# EAGLE design interface_dac_sma_feedback_2PS_ADC_detector_ACDC (EAGLE 7.2.0)
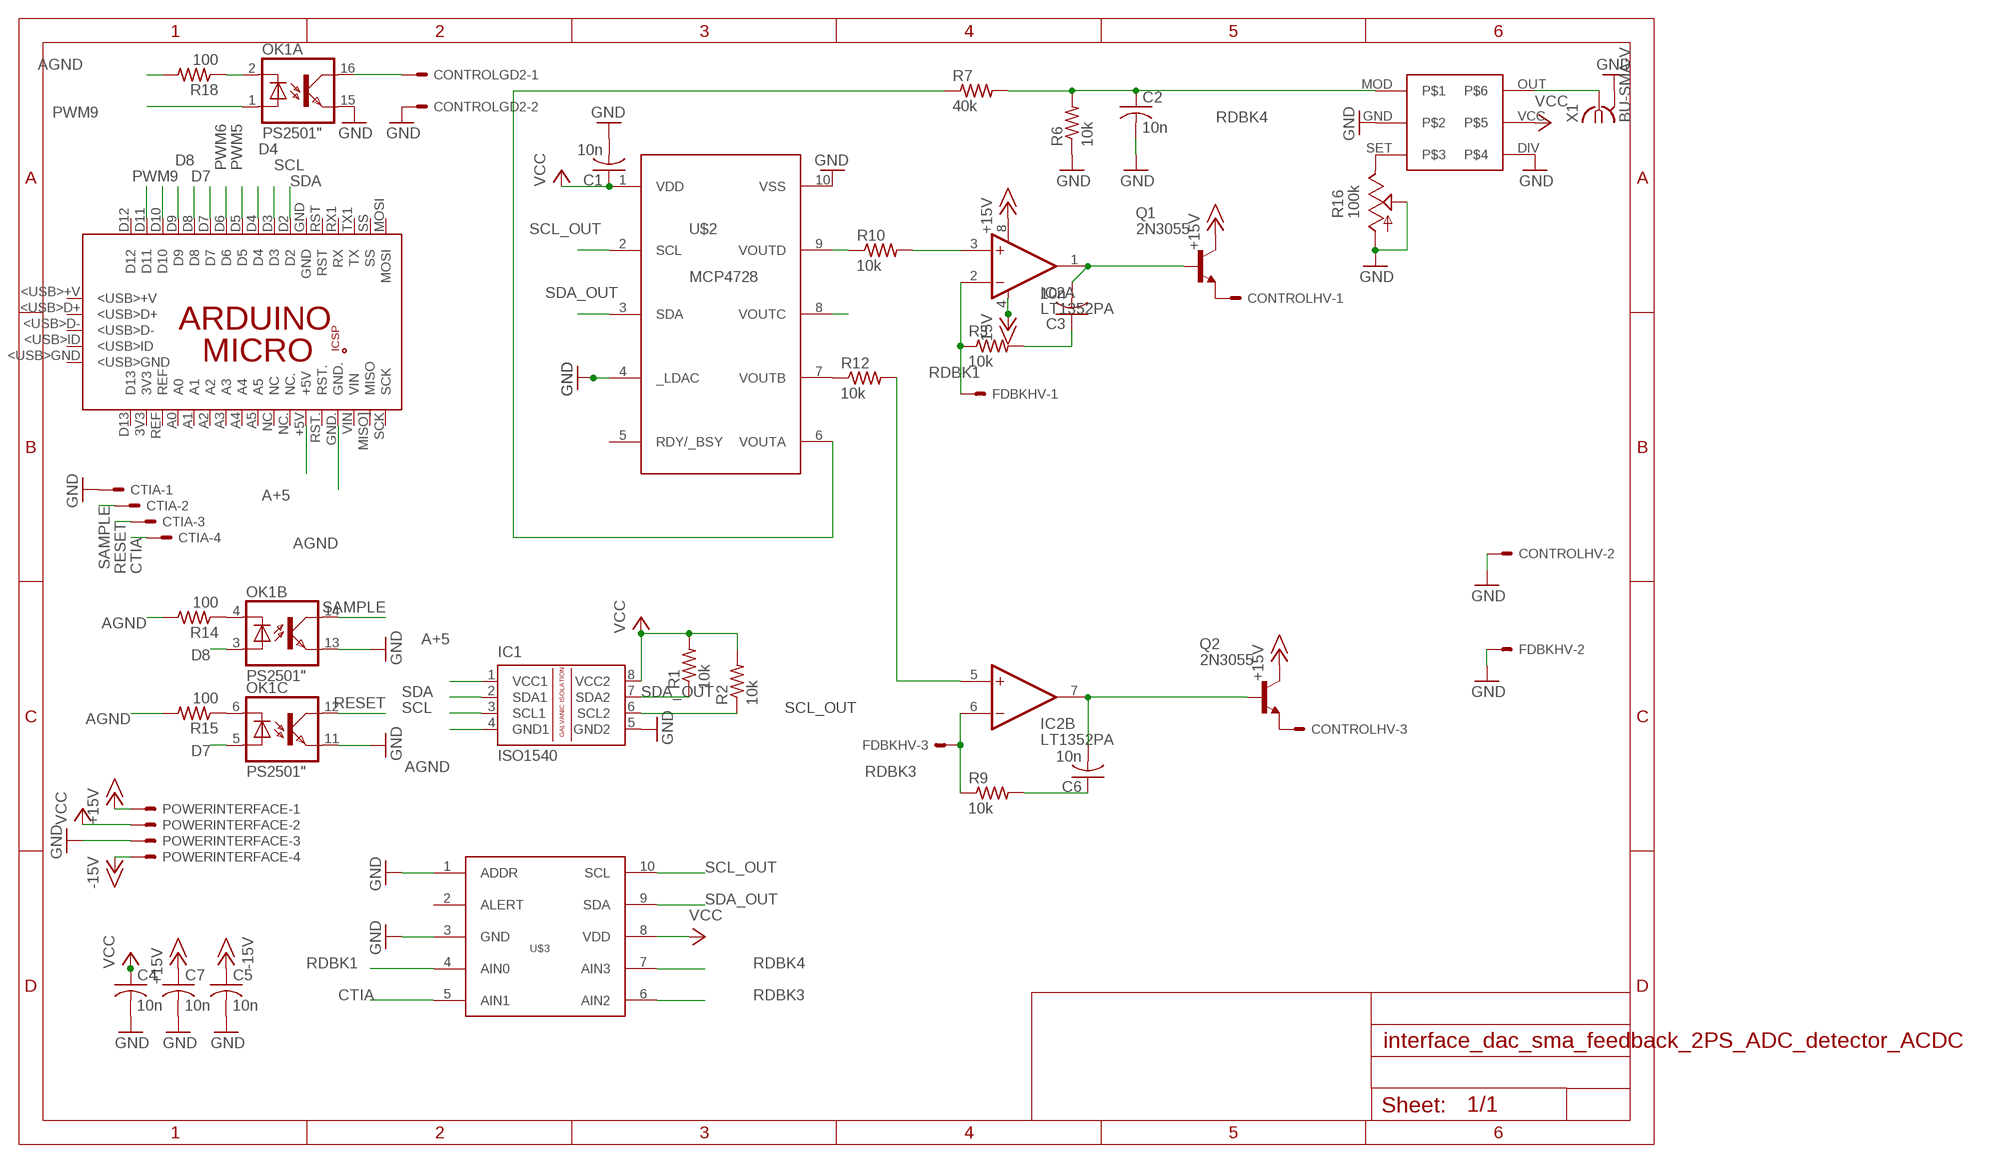
[diagram p0: schematic, sheet 1]

## Parts
C1  10n  C-US050-024X044  [C050-024X044]
C2  10n  C-US050-024X044  [C050-024X044]
C3  10n  C-US050-024X044  [C050-024X044]
C4  10n  C-US050-024X044  [C050-024X044]
C5  10n  C-US050-024X044  [C050-024X044]
C6  10n  C-US050-024X044  [C050-024X044]
C7  10n  C-US050-024X044  [C050-024X044]
CONTROLGD2  KK-156-2  [KK-156-2]
CONTROLHV  KK-156-3  [KK-156-3]
CTIA  KK-156-4  [KK-156-4]
FDBKHV  KK-156-3  [KK-156-3]
IC1  ISO1540  [DIL08]
IC2  LT1352PA  [DIL08]
OK1  PS2501"  [DIL16]
PCB1  ARDUINO_MICRO  [ARDUINO_MICRO]
POWERINTERFACE  KK-156-4  [KK-156-4]
Q1  2N3055  [TO3]
Q2  2N3055  [TO3]
R1  10k  R-US_0207/12  [0207/12]
R2  10k  R-US_0207/10  [0207/10]
R3  10k  R-US_0207/10  [0207/10]
R6  10k  R-US_0207/10  [0207/10]
R7  40k  R-US_0207/10  [0207/10]
R9  10k  R-US_0207/10  [0207/10]
R10  10k  R-US_0207/10  [0207/10]
R12  10k  R-US_0207/10  [0207/10]
R14  100  R-US_0207/10  [0207/10]
R15  100  R-US_0207/10  [0207/10]
R16  100k  TRIM_US-B90P  [SP19L]
R18  100  R-US_0207/10  [0207/10]
U$1  LTC6992  [DIL06]
U$2  MCP4728DIL  [DIL10]
U$3  ADS1015DIL  [DIL10]
X1  BU-SMA-V  [BU-SMA-V]

## Nets
+15V: C7.1 IC2.8(A:V+) POWERINTERFACE.1 Q1.C Q1.C/(C) Q2.C Q2.C/(C)
-15V: C5.1 IC2.4(A:V-) POWERINTERFACE.4
A+5: IC1.1(VCC1) PCB1.+5V
AGND: IC1.4(GND1) PCB1.GND. R14.2 R15.2 R18.2
CTIA: CTIA.4 U$3.5(AIN1)
D4: PCB1.D4
D7: OK1.5(C:A) PCB1.D7
D8: OK1.3(B:A) PCB1.D8
D10: PCB1.D10
D11: PCB1.D11
ENSW2: CONTROLGD2.1 OK1.16(A:COL)
GND: C1.2 C2.2 C4.2 C5.2 C7.2 CONTROLGD2.2 CONTROLHV.2 CTIA.1 FDBKHV.2 IC1.5(GND2) OK1.11(C:EMI) OK1.13(B:EMI) OK1.15(A:EMI) POWERINTERFACE.3 R6.1 R16.A R16.S U$1.DIV U$1.GND U$2.4(_LDAC) U$2.10(VSS) U$3.1(ADDR) U$3.3(GND) X1.2 X1.3 X1.4 X1.5
N$1: R7.1 U$2.6(VOUTA)
N$2: OK1.4(B:C) R14.1
N$3: C3.1 R3.2
N$4: CONTROLHV.1 Q1.E
N$5: CONTROLHV.3 Q2.E
N$6: OK1.6(C:C) R15.1
N$7: OK1.2(A:C) R18.1
N$12: R16.E U$1.SET
N$13: U$1.OUT X1.1
N$16: IC2.3(A:+IN) R10.2
N$18: IC2.5(B:+IN) R12.2
N$19: C3.2 IC2.1(A:OUT) Q1.B
N$20: C6.1 R9.2
N$21: C6.2 IC2.7(B:OUT) Q2.B
N$24: R10.1 U$2.9(VOUTD)
N$25: R12.1 U$2.7(VOUTB)
N$26: U$2.8(VOUTC)
PWM5: PCB1.D5
PWM6: PCB1.D6
PWM9: OK1.1(A:A) PCB1.D9
RDBK1: FDBKHV.1 IC2.2(A:-IN) R3.1 U$3.4(AIN0)
RDBK3: FDBKHV.3 IC2.6(B:-IN) R9.1 U$3.6(AIN2)
RDBK4: C2.1 R6.2 R7.2 U$1.MOD U$3.7(AIN3)
RESET: CTIA.3 OK1.12(C:COL)
SAMPLE: CTIA.2 OK1.14(B:COL)
SCL: IC1.3(SCL1) PCB1.D3
SCL_OUT: IC1.6(SCL2) R2.1 U$2.2(SCL) U$3.10(SCL)
SDA: IC1.2(SDA1) PCB1.D2
SDA_OUT: IC1.7(SDA2) R1.1 U$2.3(SDA) U$3.9(SDA)
VCC: C1.1 C4.1 IC1.8(VCC2) POWERINTERFACE.2 R1.2 R2.2 U$1.VCC U$2.1(VDD) U$3.8(VDD)
Unconnected: OK1.7(D:A) OK1.8(D:C) OK1.9(D:EMI) OK1.10(D:COL) PCB1.3V3 PCB1.5V PCB1.<USB>+V PCB1.<USB>D+ PCB1.<USB>D- PCB1.<USB>GND PCB1.<USB>ID PCB1.A0 PCB1.A1 PCB1.A2 PCB1.A3 PCB1.A4 PCB1.A5 PCB1.D12 PCB1.D13 PCB1.GND PCB1.GND_ PCB1.MISO. PCB1.MISO](MISO) PCB1.MOSI PCB1.MOSI. PCB1.NC PCB1.NC. PCB1.REF PCB1.RESET.. PCB1.RST PCB1.RST. PCB1.RX1(RX) PCB1.SCK PCB1.SCK. PCB1.SS PCB1.TX1(TX) PCB1.VIN U$2.5(RDY/_BSY) U$3.2(ALERT)

## Library data of the parts
C1 = rcl:C-US: CAPACITOR, American symbol
C2-C7 = resistor:C-US: CAPACITOR, American symbol
CONTROLGD2 = con-molex:KK-156-2: KK 156 HEADER Source: http://www.molex.com/pdm_docs/sd/026604100_sd.pdf; OC_FARNELL: unknown; OC_NEWARK: unknown
CONTROLHV FDBKHV = con-molex:KK-156-3: KK 156 HEADER Source: http://www.molex.com/pdm_docs/sd/026604100_sd.pdf; OC_FARNELL: unknown; OC_NEWARK: unknown
CTIA POWERINTERFACE = con-molex:KK-156-4: KK 156 HEADER Source: http://www.molex.com/pdm_docs/sd/026604100_sd.pdf; OC_FARNELL: unknown; OC_NEWARK: unknown
IC1 = texas:ISO1540: ISOLATED CAN TRANSCEIVER Source: http://focus.ti.com/lit/ds/symlink/iso1050.pdf
IC2 = linear-technology:LT1352: Dual Operational Amplifiers Source: http://datasheets.maxim-ic.com/en/ds/ICL7612-ICL764X.pdf; OC_FARNELL: unknown; OC_NEWARK: unknown
OK1 = optocoupler:PS2501: SHARP OPTO COUPLER
PCB1 = E14_Arduino_published:ARDUINO_MICRO: Device for representing an Arduino Micro board with a footprint in an EAGLE design. Created by Dave Young for Element14. More EAGLE documentation at: http://www.element14.com/community/community/knode/cadsoft_eagle
Q1 Q2 = transistor-npn:2N3055: NPN Transistor
R1-R3 R6 R7 R9 R10 R12 = resistor:R-US_: RESISTOR, American symbol
R14 R15 R18 = rcl:R-US_: RESISTOR, American symbol
R16 = pot:TRIM_US-: POTENTIOMETER
U$1 = linear-technology:LTC6992
U$2 = microchip:MCP4728
U$3 = texas:ADS1015
X1 = con-coax:BU-SMA-V: FEMALE SMA CONNECTOR Radiall distributor RS 112-3794; OC_FARNELL: unknown; OC_NEWARK: unknown

## Board
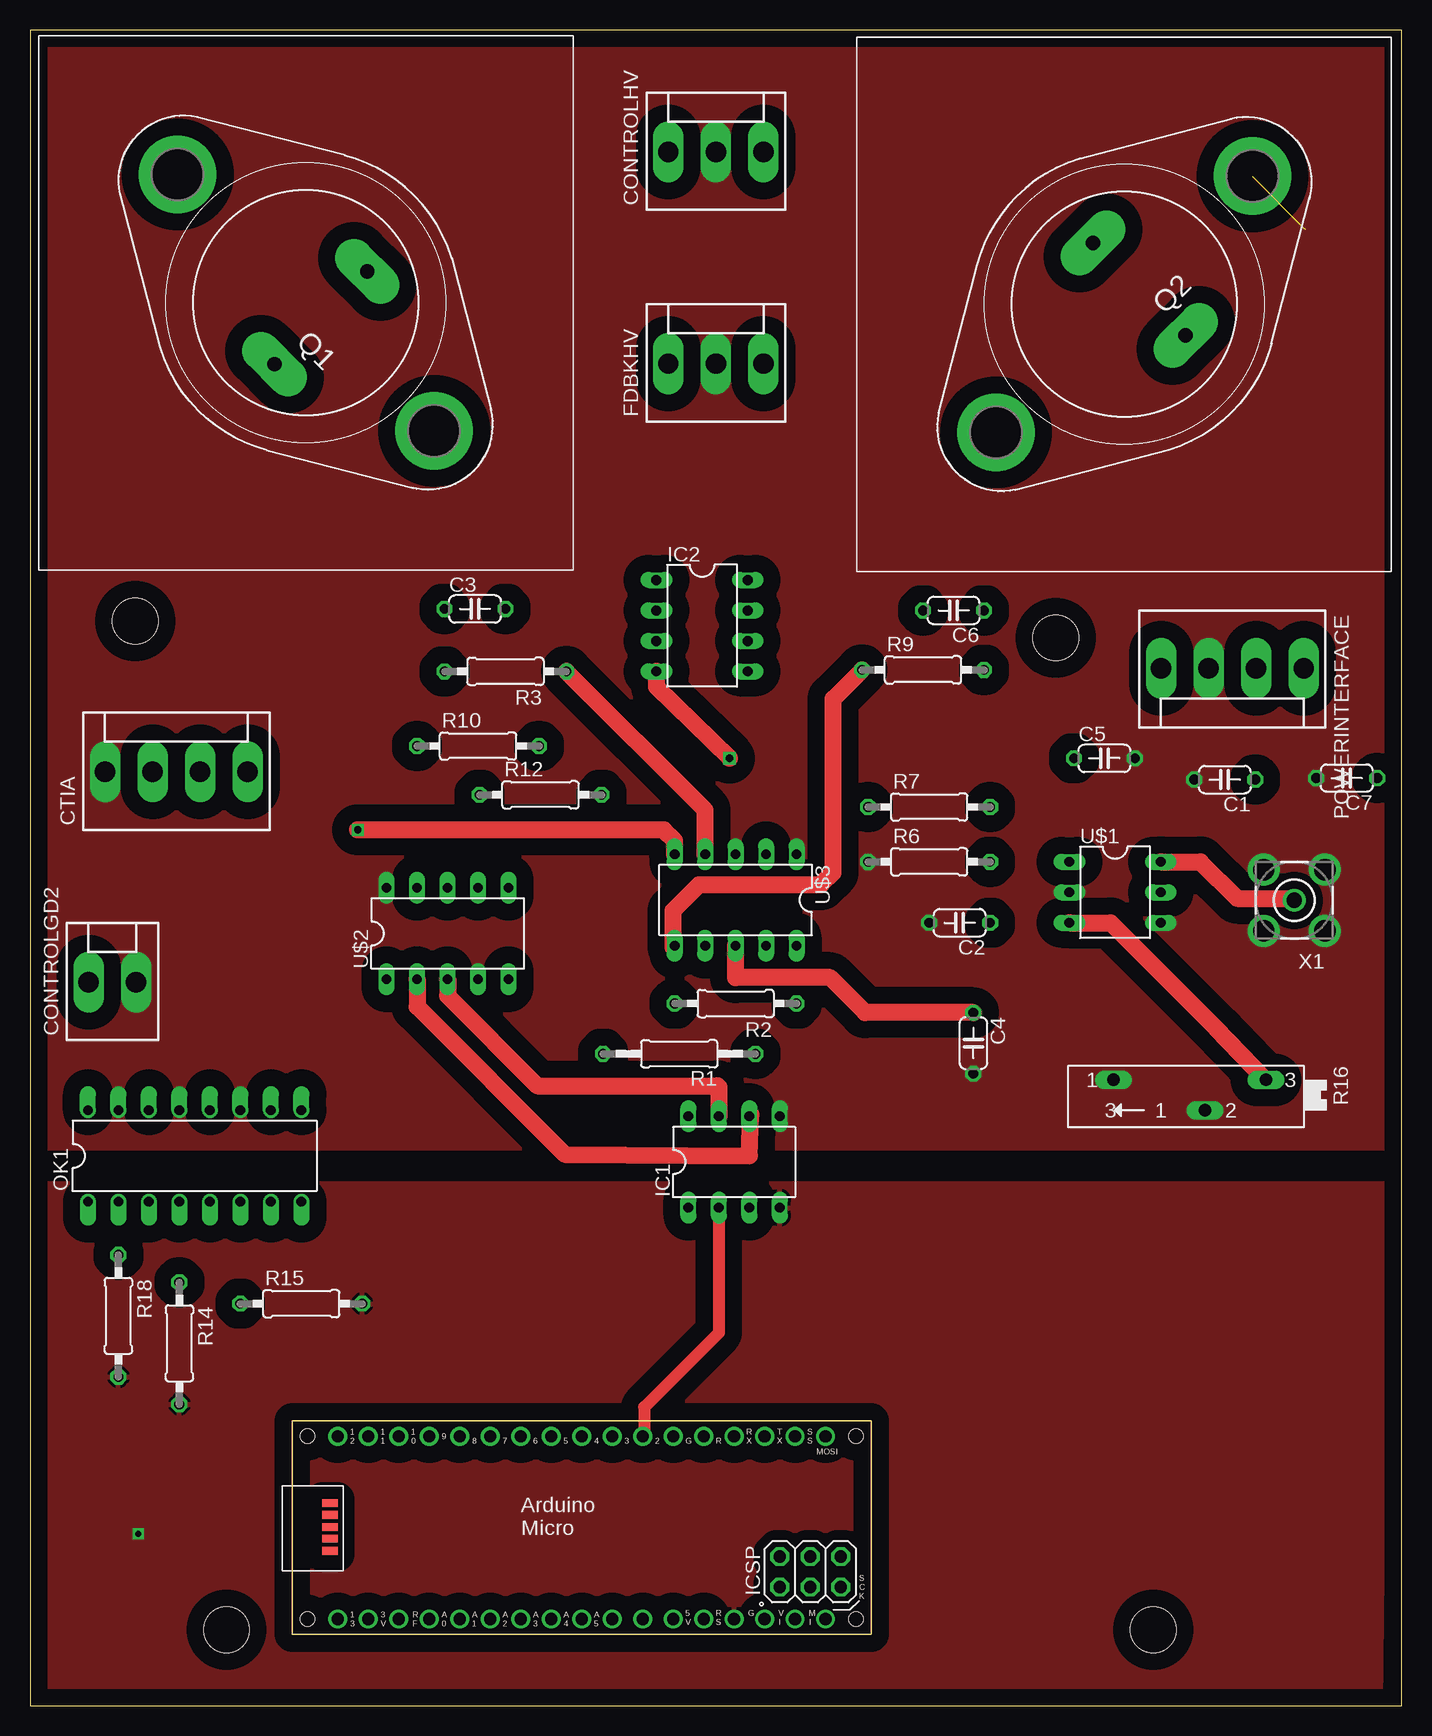
[diagram p1: board, top side]
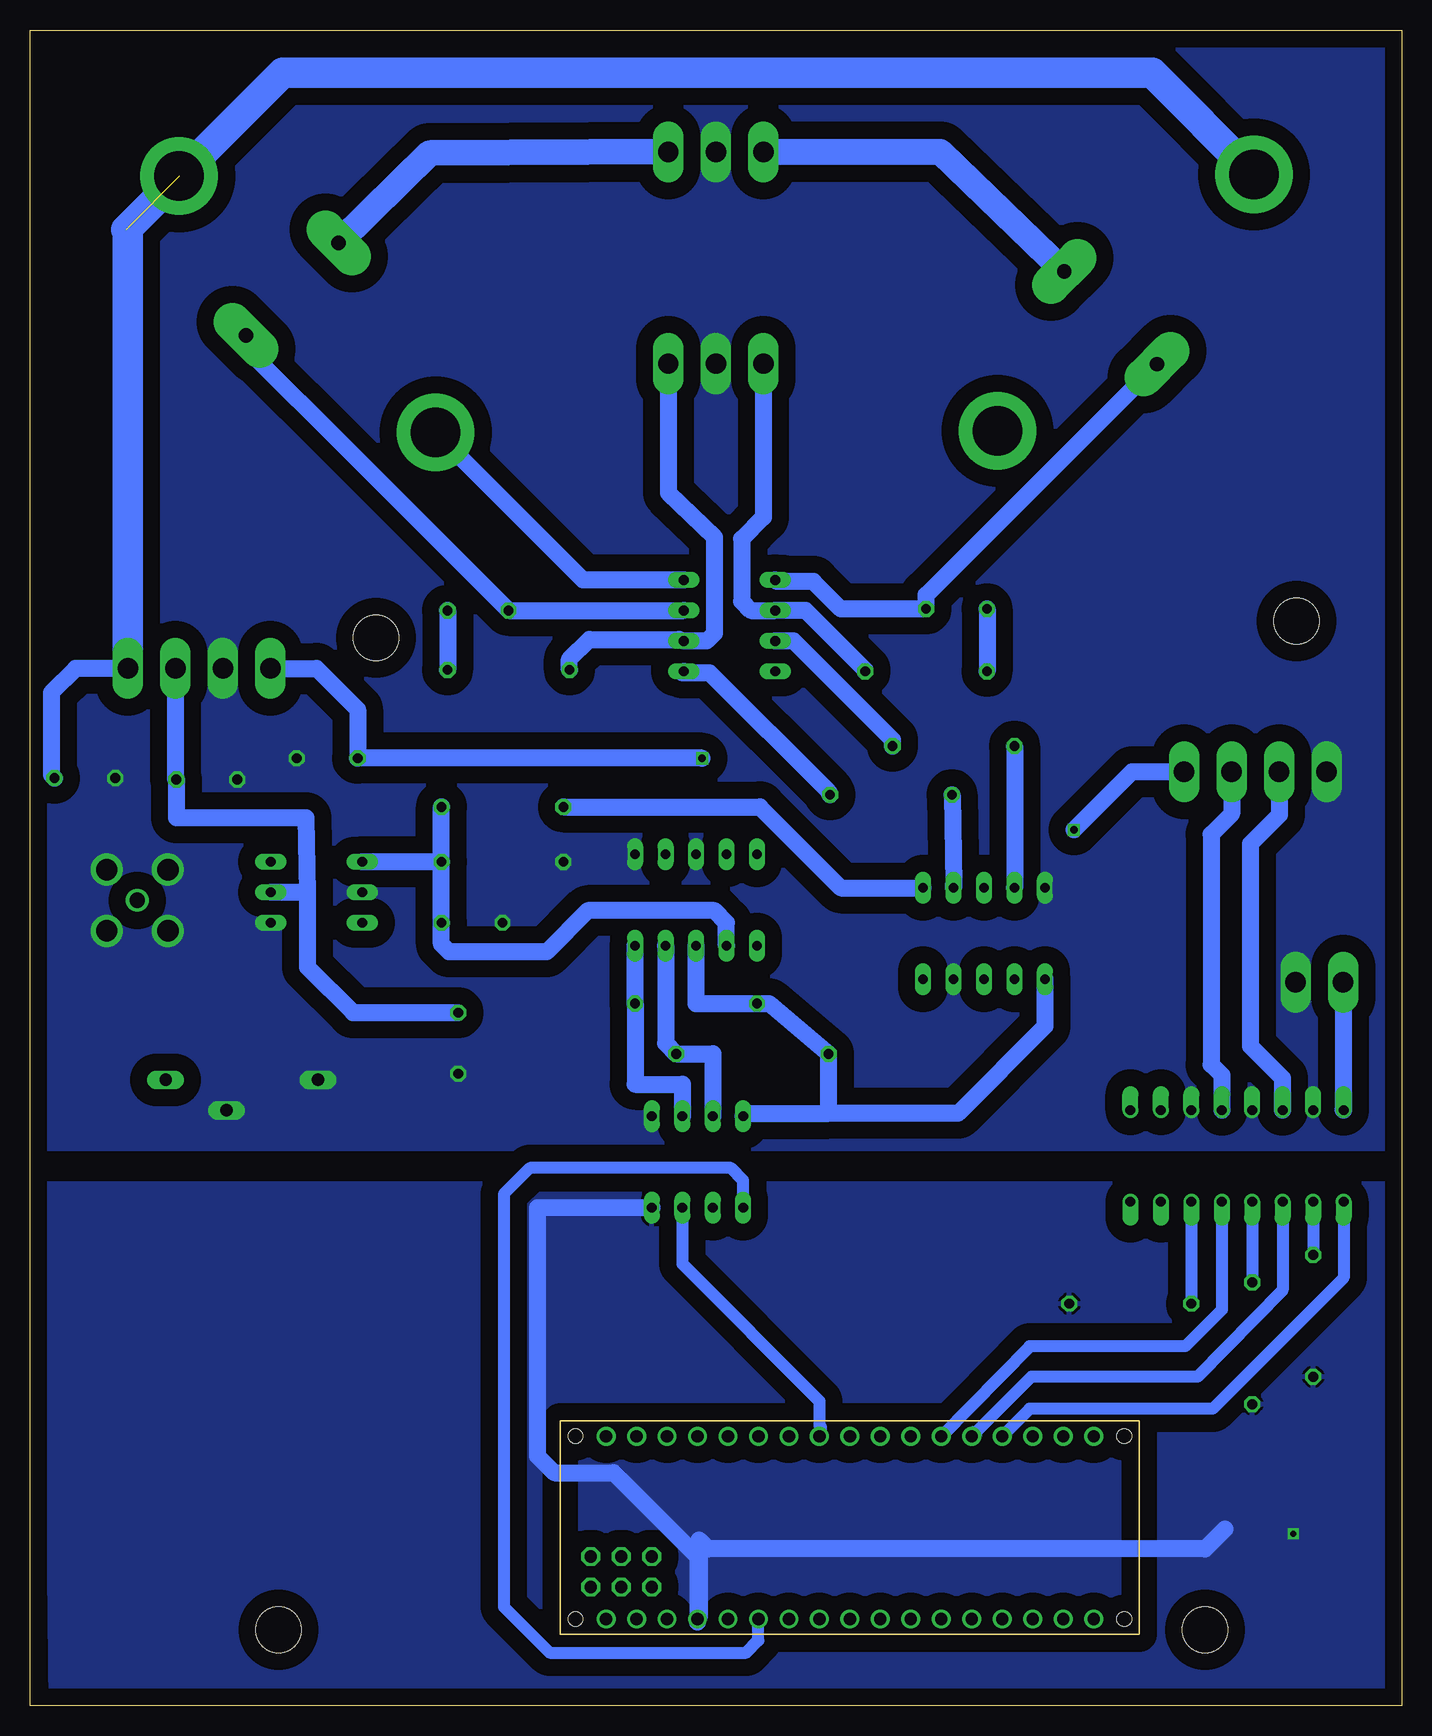
[diagram p2: board, bottom side, seen from below]

Size 114.3 x 139.7 mm. Coordinates in mm from the lower left corner, seen from the top.
Outline: 0,0 114.3,0 114.3,139.7 0,139.7 0,0
Copper layers (1*16): Top 0.035mm / dielectric 1.5mm / Bottom 0.035mm
Design rules "default *": minimum track width 6mil, minimum drill 15mil, track to track 6mil, track to pad 6mil, pad to pad 6mil, via to via 6mil, smd to smd 6mil, copper to edge 40mil, drill to drill 8mil, minimum pad ring 10mil, minimum via ring 8mil, stop-mask expansion 4mil, vias tented up to drill 0mil, thermal gap 10mil
Holes 3.8 mm at 93.6,6.35 16.38,6.35 8.76,90.42 85.47,89.03

### Footprints (pad centres in the part's own frame; a part is rotated, then mirrored left to right if it is on the bottom)
C050-024X044 = drill 0.813 octagon: 1 -2.54,0; 2 2.54,0
KK-156-2 = drill 1.7 pad 2.184 long: 1 -1.98,0; 2 1.98,0
KK-156-3 = drill 1.7 pad 2.184 long: 1 -3.96,0; 2 0,0; 3 3.96,0
KK-156-4 = drill 1.7 pad 2.184 long: 1 -5.94,0; 2 -1.98,0; 3 1.98,0; 4 5.94,0
DIL08 = drill 0.813 long: 1 -3.81,-3.81; 2 -1.27,-3.81; 3 1.27,-3.81; 4 3.81,-3.81; 5 3.81,3.81; 6 1.27,3.81; 7 -1.27,3.81; 8 -3.81,3.81
DIL16 = drill 0.813 offset: 1 -8.89,-3.81; 2 -6.35,-3.81; 3 -3.81,-3.81; 4 -1.27,-3.81; 5 1.27,-3.81; 6 3.81,-3.81; 7 6.35,-3.81; 8 8.89,-3.81; 9 8.89,3.81; 10 6.35,3.81; 11 3.81,3.81; 12 1.27,3.81; 13 -1.27,3.81; 14 -3.81,3.81; 15 -6.35,3.81; 16 -8.89,3.81
ARDUINO_MICRO = drill 1.016 pad 1.575: 3V3 6.35,1.27; +5V 31.75,1.27; A0 11.43,1.27; A1 13.97,1.27; A2 16.51,1.27; A3 19.05,1.27; A4 21.59,1.27; A5 24.13,1.27; D2 29.21,16.51; D3 26.67,16.51; D4 24.13,16.51; D5 21.59,16.51; D6 19.05,16.51; D7 16.51,16.51; D8 13.97,16.51; D9 11.43,16.51; D10 8.89,16.51; D11 6.35,16.51; D12 3.81,16.51; D13 3.81,1.27; GND 31.75,16.51; GND. 36.83,1.27; MISO] 41.91,1.27; MOSI 44.45,16.51; NC 26.67,1.27; NC. 29.21,1.27; REF 8.89,1.27; RST 34.29,16.51; RST. 34.29,1.27; RX1 36.83,16.51; SCK 44.45,1.27; SS 41.91,16.51; TX1 39.37,16.51; VIN 39.37,1.27 | drill 1.016 pad 1.575 octagon: 5V 40.64,6.477; GND_ 45.72,6.477; MISO. 40.64,3.937; MOSI. 43.18,6.477; RESET.. 45.72,3.937; SCK. 43.18,3.937 | smd 1.27 x 0.635: <USB>+V 3.15,10.947; <USB>D+ 3.15,9.957; <USB>D- 3.15,8.941; <USB>GND 3.15,6.96; <USB>ID 3.15,7.976 | hole 1.2: 1.27,1.27; 1.27,16.51; 46.99,16.51; 46.99,1.27
TO3 = drill 1.194 pad 3.15 long: B -1.778,5.461; E -1.778,-5.461 | drill 4.115 pad 6.477: C 15.113,0; C/ -15.113,0
0207/12 = drill 0.813 octagon: 1 -6.35,0; 2 6.35,0
0207/10 = drill 0.813 octagon: 1 -5.08,0; 2 5.08,0
SP19L = drill 1.016 long: A 5.715,-1.27; E -6.985,-1.27; S -1.905,1.27
DIL06 = drill 0.813 long: DIV 2.54,3.81; GND 0,-3.81; MOD -2.54,-3.81; OUT -2.54,3.81; SET 2.54,-3.81; VCC 0,3.81
DIL10 = drill 0.813 long: 1 -5.08,-3.81; 2 -2.54,-3.81; 3 0,-3.81; 4 2.54,-3.81; 5 5.08,-3.81; 6 5.08,3.81; 7 2.54,3.81; 8 0,3.81; 9 -2.54,3.81; 10 -5.08,3.81
BU-SMA-V = drill 1.27: 1 0,0 | drill 1.778: 2 -2.55,2.55; 3 2.55,2.55; 4 2.55,-2.55; 5 -2.55,-2.55

### Placement (x,y rotation side)
C1  99.57,77.22 180 top
C2  77.47,65.28 180 top
C3  37.08,91.44 0 top
C4  78.61,55.24 270 top
C5  89.53,78.99 0 top
C6  76.96,91.31 180 top
C7  109.73,77.34 180 top
CONTROLGD2  6.86,60.33 0 top
CONTROLHV  57.15,129.54 0 top
CTIA  12.19,77.85 0 top
FDBKHV  57.15,111.89 0 top
IC1  58.67,45.34 0 top
IC2  56.01,90.04 270 top
OK1  13.72,45.85 0 top
PCB1  21.84,5.97 0 top
POWERINTERFACE  100.2,86.49 180 top
Q1  22.99,116.97 135 top
Q2  91.19,116.84 225 top
R1  54.1,54.36 180 top
R2  58.8,58.55 180 top
R3  39.62,86.23 180 top
R6  74.93,70.36 0 top
R7  74.93,74.93 0 top
R9  74.42,86.36 0 top
R10  37.34,80.01 0 top
R12  42.55,75.95 0 top
R14  12.45,30.23 270 top
R15  22.61,33.53 0 top
R16  96.01,50.93 180 top
R18  7.37,32.51 270 top
U$1  90.42,67.82 270 top
U$2  34.8,64.39 0 top
U$3  58.8,67.18 180 top
X1  105.36,67.16 180 top

### Tracks (layer width: path | path; a pad name or v marks a point on that pad's centre or on a via)
+15V  (2 unrouted)
  Bottom 1.422: POWERINTERFACE.1 110.49,86.49 112.52,84.45 112.52,77.6 C7.1 | IC2.8 68.2,93.85 Q2.C
  Bottom 2.54: 106.3,123.06 93.22,136.14 20.79,136.14 Q1.C | POWERINTERFACE.1 106.14,123.16
-15V  (via drill 0.6)
  Top 1.422: IC2.4 52.2,84.96 v58.29,78.99
  Bottom 1.422: POWERINTERFACE.4 90.42,86.49 87,83.06 C5.1 v58.29,78.99
A+5
  Bottom 1.016: PCB1.+5V 53.59,5.46 54.61,4.45 70.99,4.45 72.39,5.84 74.8,8.26 74.8,42.67 72.64,44.83 55.88,44.83 54.86,43.81 IC1.1
AGND  (via drill 0.5 pad 0.3)
  Bottom 1.422: PCB1.GND. 58.67,12.45 65.66,19.43 70.61,19.43 72.01,20.83 72.01,41.53 IC1.4 | PCB1.GND. 58.67,6.99 | 14.73,14.73 16.38,13.08 57.78,13.08 58.55,13.84 58.55,7.37 PCB1.GND.
  other vias: 9.02,14.35
  pour Bottom (isolate 1.422): -0.13,0.13 112.52,0.13 113.03,43.56 0.13,43.56
  pour Top (isolate 1.422): 0.13,43.56 113.03,43.56 112.52,0.13 0.25,-0.13
CTIA  (via drill 0.6)
  Top 1.422: U$3.5 53.72,72.14 52.83,73.03 v27.3,73.03
  Bottom 1.422: CTIA.4 22.48,77.85 v27.3,73.03
D7
  Bottom 1.016: OK1.5 14.99,33.02 18.03,29.97 30.99,29.97 PCB1.D7
D8
  Bottom 1.016: OK1.3 9.91,34.67 17.02,27.43 30.86,27.43 PCB1.D8
  Bottom 1.422: 35.69,22.61 PCB1.D8
ENSW2
  Bottom 1.422: CONTROLGD2.1 4.88,49.71 OK1.16
GND
  pour Bottom (isolate 1.422, no thermals): -0.13,139.7 114.3,139.7 114.3,46.48 0,46.48
  pour Top (isolate 1.422, no thermals): -0.13,139.7 114.3,139.7 114.3,46.48 0,46.48
N$1
  Bottom 1.422: R7.1 53.47,74.93 46.74,68.2 U$2.6
N$2
  Bottom 1.016: OK1.4 R14.1
N$3
  Bottom 1.422: C3.1 R3.2
N$4
  Bottom 2.184: CONTROLHV.1 38.45,129.54 Q1.E
N$5
  Bottom 2.184: CONTROLHV.3 81,129.41 Q2.E
N$6
  Bottom 1.016: OK1.6 R15.1
N$7
  Bottom 1.016: OK1.2 R18.1
N$12
  Top 1.422: U$1.SET 90.04,65.28 98.81,56.52 R16.E
N$13
  Top 1.422: U$1.OUT 97.54,70.36 100.58,67.31 105.21,67.31 X1.1
N$16
  Bottom 1.422: R10.2 42.42,80.52 50.67,88.77 IC2.3
N$18
  Bottom 1.422: R12.2 47.75,76.2 57.66,86.11 59.94,86.11 IC2.5
N$19
  Bottom 1.422: IC2.1 52.07,93.73 49.02,93.73 46.74,91.44 C3.2 39.62,92.61 Q1.B
N$20
  Bottom 1.422: C6.1 R9.2
N$21
  Bottom 1.422: IC2.7 C6.2 87.25,104.14 87.54,104.43 96.31,113.2 Q2.B
N$24
  Bottom 1.422: R10.1 U$2.9
N$25
  Bottom 1.422: R12.1 37.34,68.45 U$2.7
PWM9
  Bottom 1.016: OK1.1 4.83,35.69 15.75,24.77 30.99,24.77 PCB1.D9
RDBK1
  Top 1.422: U$3.4 56.26,74.68 R3.1
  Bottom 1.422: R3.1 44.7,86.36 49.66,91.31 IC2.2 54.23,91.31 54.99,92.08 54.99,97.28 53.19,99.08 FDBKHV.1
RDBK3
  Top 1.422: U$3.6 53.59,63.25 53.59,66.29 55.75,68.45 65.91,68.45 66.93,69.47 66.93,83.95 R9.1
  Bottom 1.422: R9.1 69.34,87.25 67.69,88.9 60.2,88.9 IC2.6 57.91,88.77 57.28,89.41 57.28,97.41 61.11,101.11 FDBKHV.3
RDBK4
  Bottom 1.422: U$3.7 56.26,65.28 57.28,66.29 67.82,66.29 71.25,62.87 79.38,62.87 80.01,63.5 C2.1 R6.2 | R6.2 R7.2 | R6.2 U$1.MOD
RESET
  Bottom 1.422: CTIA.3 14.17,74.35 15.88,72.64 15.88,53.47 14.99,52.58 OK1.12
SAMPLE
  Bottom 1.422: OK1.14 9.91,52.32 12.57,54.99 12.57,71.88 10.16,74.3 10.16,77.8 CTIA.2
SCL
  Bottom 1.016: IC1.3 59.94,36.83 48.51,25.4 48.51,23.37 48.39,23.24 48.39,22.61 PCB1.D3
SCL_OUT
  Top 1.422: U$2.2 32.26,58.29 44.58,45.97 59.94,45.85 60.07,49.28 IC1.6
  Bottom 1.422: U$3.10 R2.1 63.88,51.82 59.94,51.82 IC1.6
SDA
  Top 1.016: IC1.2 57.4,31.11 51.18,24.89 51.18,22.61 PCB1.D2
SDA_OUT
  Top 1.422: U$2.3 34.8,59.18 42.29,51.69 57.28,51.69 57.4,51.56 IC1.7
  Bottom 1.422: IC1.7 57.4,54.36 R1.1 61.34,55.24 U$3.9
VCC
  Top 1.422: C4.1 69.6,57.78 66.67,60.71 58.8,60.71 U$3.8
  Bottom 1.422: POWERINTERFACE.2 102.18,77.29 C1.1 102.11,74.04 91.31,74.04 91.19,67.82 | 91.19,67.82 U$1.VCC | U$3.8 58.8,58.55 R2.2 52.7,58.55 R1.2 47.75,49.4 | U$2.1 29.72,56.64 36.96,49.4 47.75,49.4 | IC1.8 54.61,49.4 47.75,49.4 | 91.19,67.82 91.19,61.59 87.38,57.78 C4.1